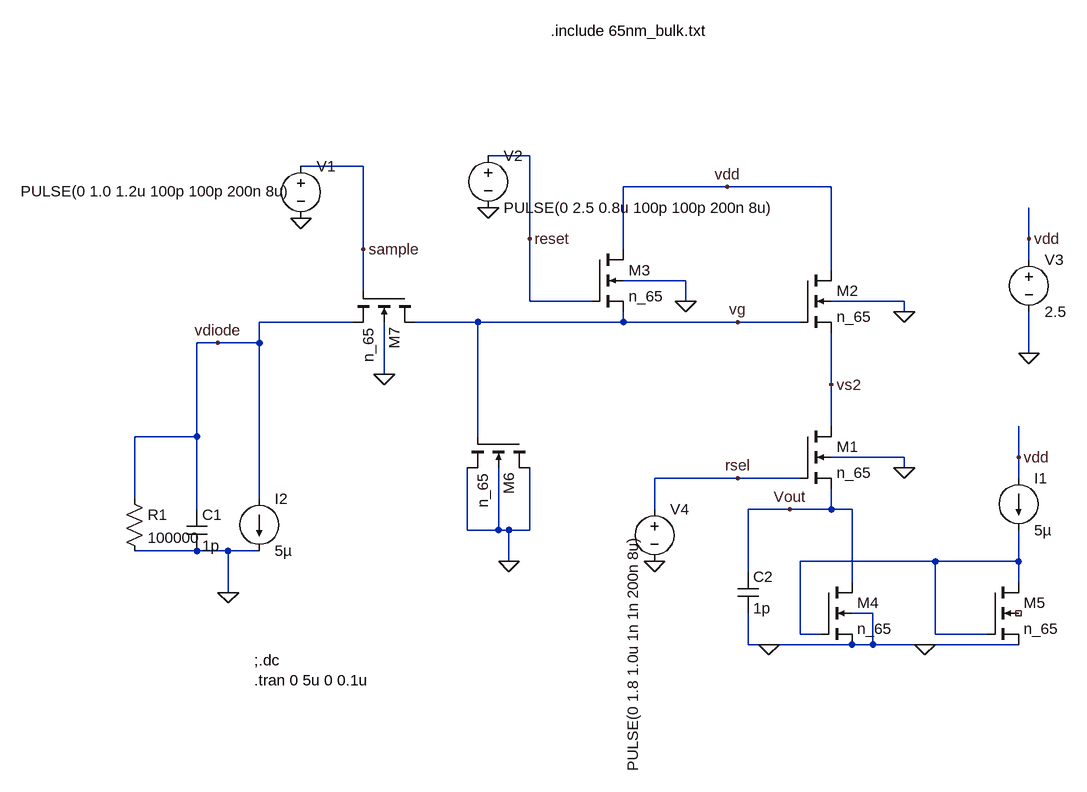
[diagram p0: schematic Corrected_4T_Pixel_SourceFollower.asc]
Corrected_4T_Pixel_SourceFollower.asc, the LTspice schematic file:
Version 4.1
SHEET 1 880 680
WIRE -64 -384 -128 -384
WIRE -320 -368 -416 -368
WIRE 240 -336 80 -336
WIRE 400 -336 240 -336
WIRE -64 -256 -64 -384
WIRE 704 -256 704 -304
WIRE -320 -240 -320 -368
WIRE 80 -240 80 -336
WIRE 704 -224 704 -256
WIRE 400 -208 400 -336
WIRE 176 -192 80 -192
WIRE -320 -176 -320 -240
WIRE -64 -160 -64 -256
WIRE 32 -160 -64 -160
WIRE 176 -160 176 -192
WIRE 512 -160 400 -160
WIRE 512 -144 512 -160
WIRE -336 -128 -480 -128
WIRE -144 -128 -240 -128
WIRE 80 -128 80 -144
WIRE 80 -128 -144 -128
WIRE 256 -128 80 -128
WIRE 352 -128 256 -128
WIRE -544 -96 -576 -96
WIRE -480 -96 -480 -128
WIRE -480 -96 -544 -96
WIRE 704 -80 704 -144
WIRE -288 -48 -288 -128
WIRE 400 -32 400 -112
WIRE 400 32 400 -32
WIRE -576 48 -576 -96
WIRE -576 48 -672 48
WIRE -144 48 -144 -128
WIRE 512 80 400 80
WIRE 688 80 688 32
WIRE 512 96 512 80
WIRE 256 112 128 112
WIRE 352 112 256 112
WIRE 688 112 688 80
WIRE -672 144 -672 48
WIRE -480 144 -480 -96
WIRE -576 160 -576 48
WIRE 128 160 128 112
WIRE 336 160 272 160
WIRE 400 160 400 128
WIRE 400 160 336 160
WIRE 432 160 400 160
WIRE -160 192 -160 96
WIRE -112 192 -112 96
WIRE -112 192 -160 192
WIRE -96 192 -112 192
WIRE -64 192 -64 96
WIRE -64 192 -96 192
WIRE -576 224 -672 224
WIRE -528 224 -576 224
WIRE -480 224 -528 224
WIRE -96 240 -96 192
WIRE 560 240 352 240
WIRE 688 240 688 192
WIRE 688 240 560 240
WIRE 272 256 272 160
WIRE 432 272 432 160
WIRE 688 272 688 240
WIRE -528 288 -528 224
WIRE 464 320 432 320
WIRE 352 352 352 240
WIRE 384 352 352 352
WIRE 560 352 560 240
WIRE 640 352 560 352
WIRE 272 368 272 320
WIRE 304 368 272 368
WIRE 432 368 304 368
WIRE 464 368 464 320
WIRE 464 368 432 368
WIRE 544 368 464 368
WIRE 688 368 544 368
FLAG 304 368 0
FLAG 544 368 0
FLAG -528 288 0
FLAG -288 -48 0
FLAG -96 240 0
FLAG 176 -160 0
FLAG 512 -144 0
FLAG 512 96 0
FLAG 704 -80 0
FLAG -128 -304 0
FLAG -416 -288 0
FLAG 128 240 0
FLAG 240 -336 vdd
FLAG 704 -256 vdd
FLAG 688 80 vdd
FLAG -64 -256 reset
FLAG -320 -240 sample
FLAG -544 -96 vdiode
FLAG 336 160 Vout
FLAG 256 112 rsel
FLAG 400 -32 vs2
FLAG 256 -128 vg
SYMBOL nmos4 352 32 R0
SYMATTR InstName M1
SYMATTR Value n_65
SYMATTR Value2 l=65n w=1u
SYMBOL nmos4 352 -208 R0
SYMATTR InstName M2
SYMATTR Value n_65
SYMATTR Value2 l=300n w=4u
SYMBOL nmos4 32 -240 R0
SYMATTR InstName M3
SYMATTR Value n_65
SYMATTR Value2 l=300n w=2u
SYMBOL nmos4 384 272 R0
SYMATTR InstName M4
SYMATTR Value n_65
SYMATTR Value2 l=0.5u w=1u
SYMBOL nmos4 640 272 R0
SYMATTR InstName M5
SYMATTR Value n_65
SYMATTR Value2 l=0.5u w=2u
SYMBOL nmos4 -64 48 R90
SYMATTR InstName M6
SYMATTR Value n_65
SYMATTR Value2 l=5u w=5u
SYMBOL nmos4 -240 -176 R90
SYMATTR InstName M7
SYMATTR Value n_65
SYMATTR Value2 l=300n w=2u
SYMBOL voltage -416 -384 R0
WINDOW 3 -431 55 Left 2
WINDOW 123 0 0 Left 0
WINDOW 39 0 0 Left 0
SYMATTR Value PULSE(0 1.0 1.2u 100p 100p 200n 8u)
SYMATTR InstName V1
SYMBOL voltage -128 -400 R0
WINDOW 123 0 0 Left 0
WINDOW 39 0 0 Left 0
SYMATTR InstName V2
SYMATTR Value PULSE(0 2.5 0.8u 100p 100p 200n 8u)
SYMBOL voltage 704 -240 R0
WINDOW 123 0 0 Left 0
WINDOW 39 0 0 Left 0
SYMATTR InstName V3
SYMATTR Value 2.5
SYMBOL voltage 128 144 R0
WINDOW 3 -33 55 VRight 2
WINDOW 123 0 0 Left 0
WINDOW 39 0 0 Left 0
SYMATTR Value PULSE(0 1.8 1.0u 1n 1n 200n 8u)
SYMATTR InstName V4
SYMBOL current 688 112 R0
WINDOW 123 0 0 Left 0
WINDOW 39 0 0 Left 0
SYMATTR InstName I1
SYMATTR Value 5µ
SYMBOL current -480 144 R0
WINDOW 123 0 0 Left 0
WINDOW 39 0 0 Left 0
SYMATTR InstName I2
SYMATTR Value 5µ
SYMBOL res -688 128 R0
SYMATTR InstName R1
SYMATTR Value 100000
SYMBOL cap -592 160 R0
SYMATTR InstName C1
SYMATTR Value 1p
SYMBOL cap 256 256 R0
SYMATTR InstName C2
SYMATTR Value 1p
TEXT -32 -576 Left 2 !.include 65nm_bulk.txt
TEXT -488 392 Left 2 !;.dc\n.tran 0 5u 0 0.1u

The netlist it stands for:
* Corrected_4T_Pixel_SourceFollower.asc
M1 vs2 rsel Vout 0 n_65 l=65n w=1u
M2 vdd vg vs2 0 n_65 l=300n w=4u
M3 vdd reset vg 0 n_65 l=300n w=2u
M4 Vout N001 0 0 n_65 l=0.5u w=1u
M5 N001 N001 0 NC_01 n_65 l=0.5u w=2u
M6 0 vg 0 0 n_65 l=5u w=5u
M7 vg sample vdiode 0 n_65 l=300n w=2u
V1 sample 0 PULSE(0 1.0 1.2u 100p 100p 200n 8u)
V2 reset 0 PULSE(0 2.5 0.8u 100p 100p 200n 8u)
V3 vdd 0 2.5
V4 rsel 0 PULSE(0 1.8 1.0u 1n 1n 200n 8u)
I1 vdd N001 5µ
I2 vdiode 0 5µ
R1 vdiode 0 100000
C1 vdiode 0 1p
C2 Vout 0 1p
.model NMOS NMOS
.model PMOS PMOS
.lib standard.mos
.include 65nm_bulk.txt
;.dc
.tran 0 5u 0 0.1u
.backanno
.end